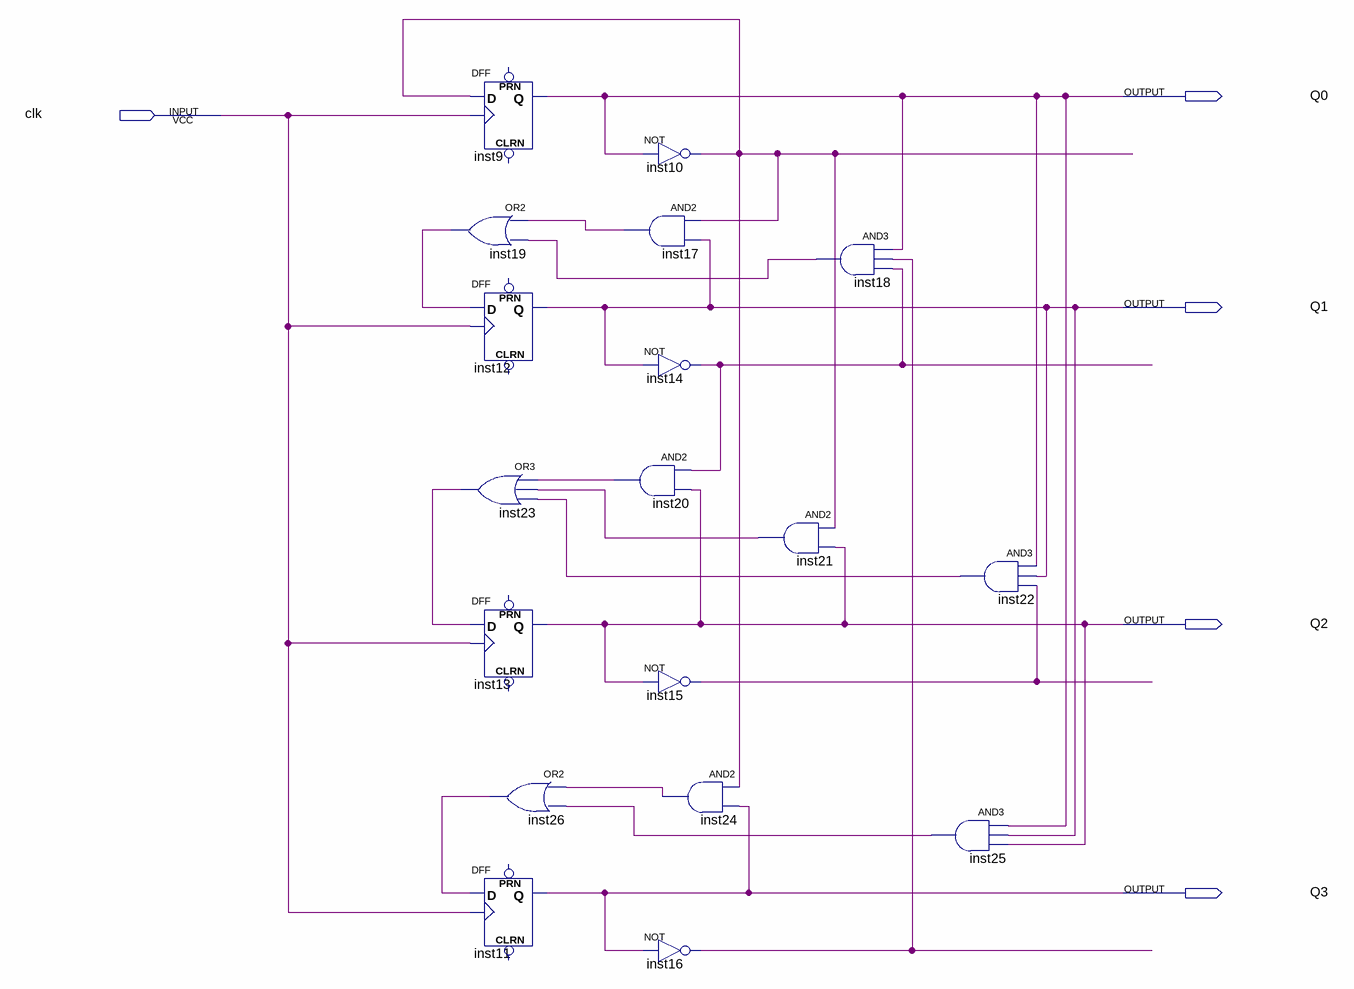
[diagram p0: schematic sheet]
// Quartus schematic counter_BCD.bdf as structural Verilog: 18 symbols, 5 pins
module counter_BCD (
  input  clk,
  output Q0,
  output Q1,
  output Q2,
  output Q3
);

  wire inst10_out, inst14_out, inst15_out, inst16_out, inst17_out, inst18_out, inst19_out, inst20_out,
       inst21_out, inst22_out, inst23_out, inst24_out, inst25_out, inst26_out;

  DFF inst9 (.CLK(clk), .D(inst10_out), .Q(Q0));  // open: CLRN, PRN
  or inst19 (inst19_out, inst17_out, inst18_out);
  DFF inst12 (.CLK(clk), .D(inst19_out), .Q(Q1));  // open: CLRN, PRN
  or inst23 (inst23_out, inst20_out, inst21_out, inst22_out);
  DFF inst13 (.CLK(clk), .D(inst23_out), .Q(Q2));  // open: CLRN, PRN
  or inst26 (inst26_out, inst24_out, inst25_out);
  DFF inst11 (.CLK(clk), .D(inst26_out), .Q(Q3));  // open: CLRN, PRN
  not inst10 (inst10_out, Q0);
  and inst17 (inst17_out, inst10_out, Q1);
  not inst14 (inst14_out, Q1);
  and inst20 (inst20_out, inst14_out, Q2);
  not inst15 (inst15_out, Q2);
  and inst24 (inst24_out, inst10_out, Q3);
  not inst16 (inst16_out, Q3);
  and inst18 (inst18_out, Q0, inst16_out, inst14_out);
  and inst21 (inst21_out, inst10_out, Q2);
  and inst22 (inst22_out, Q0, Q1, inst15_out);
  and inst25 (inst25_out, Q0, Q1, Q2);
endmodule
